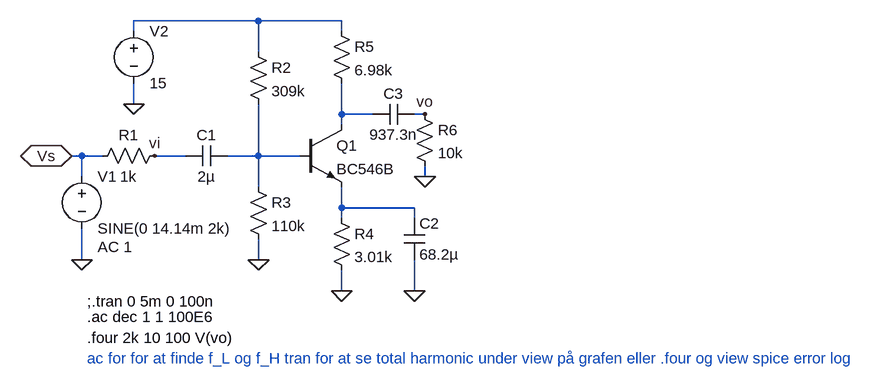
[diagram p0: schematic Draft3.asc]
Draft3.asc, the LTspice schematic file:
Version 4
SHEET 1 1448 680
WIRE 400 -80 208 -80
WIRE 528 -80 400 -80
WIRE 208 -64 208 -80
WIRE 528 -64 528 -80
WIRE 400 -32 400 -80
WIRE 208 48 208 16
WIRE 528 64 528 16
WIRE 576 64 528 64
WIRE 656 64 640 64
WIRE 528 80 528 64
WIRE 128 128 112 128
WIRE 160 128 128 128
WIRE 288 128 240 128
WIRE 400 128 400 48
WIRE 400 128 352 128
WIRE 464 128 400 128
WIRE 128 160 128 128
WIRE 656 160 656 144
WIRE 400 176 400 128
WIRE 528 208 528 176
WIRE 640 208 528 208
WIRE 528 224 528 208
WIRE 640 224 640 208
WIRE 128 288 128 240
WIRE 400 288 400 256
WIRE 528 336 528 304
WIRE 640 336 640 288
FLAG 112 128 Vs
IOPIN 112 128 BiDir
FLAG 128 288 0
FLAG 208 48 0
FLAG 400 288 0
FLAG 240 128 vi
FLAG 528 336 0
FLAG 640 336 0
FLAG 656 160 0
FLAG 656 64 vo
SYMBOL res 256 112 R90
WINDOW 0 0 56 VBottom 2
WINDOW 3 32 56 VTop 2
SYMATTR InstName R1
SYMATTR Value 1k
SYMBOL voltage 128 144 R0
WINDOW 123 24 124 Left 2
WINDOW 39 0 0 Left 0
SYMATTR InstName V1
SYMATTR Value SINE(0 14.14m 2k)
SYMATTR Value2 AC 1
SYMBOL cap 352 112 R90
WINDOW 0 0 32 VBottom 2
WINDOW 3 32 32 VTop 2
SYMATTR InstName C1
SYMATTR Value 2µ
SYMBOL voltage 208 -80 R0
WINDOW 123 0 0 Left 0
WINDOW 39 0 0 Left 0
SYMATTR InstName V2
SYMATTR Value 15
SYMBOL res 384 -48 R0
SYMATTR InstName R2
SYMATTR Value 309k
SYMBOL res 384 160 R0
SYMATTR InstName R3
SYMATTR Value 110k
SYMBOL npn 464 80 R0
SYMATTR InstName Q1
SYMATTR Value BC546B
SYMBOL res 512 208 R0
SYMATTR InstName R4
SYMATTR Value 3.01k
SYMBOL cap 624 224 R0
SYMATTR InstName C2
SYMATTR Value 68.2µ
SYMBOL res 512 -80 R0
SYMATTR InstName R5
SYMATTR Value 6.98k
SYMBOL res 640 48 R0
SYMATTR InstName R6
SYMATTR Value 10k
SYMBOL cap 640 48 R90
WINDOW 0 0 32 VBottom 2
WINDOW 3 32 32 VTop 2
SYMATTR InstName C3
SYMATTR Value 937.3n
TEXT 136 352 Left 2 !;.tran 0 5m 0 100n
TEXT 136 408 Left 2 !.four 2k 10 100 V(vo)
TEXT 136 376 Left 2 !.ac dec 1 1 100E6
TEXT 136 440 Left 2 ;ac for for at finde f_L og f_H tran for at se total harmonic under view på grafen eller .four og view spice error log

The netlist it stands for:
* Draft3.asc
R1 vi Vs 1k
V1 Vs 0 SINE(0 14.14m 2k) AC 1
C1 N003 vi 2µ
V2 N001 0 15
R2 N001 N003 309k
R3 N003 0 110k
Q1 N002 N003 N004 0 BC546B
R4 N004 0 3.01k
C2 N004 0 68.2µ
R5 N001 N002 6.98k
R6 vo 0 10k
C3 vo N002 937.3n
.model NPN NPN
.model PNP PNP
.lib standard.bjt
;.tran 0 5m 0 100n
.four 2k 10 100 V(vo)
.ac dec 1 1 100E6
* ac for for at finde f_L og f_H tran for at se total harmonic under view på grafen eller .four og view spice error log
.backanno
.end